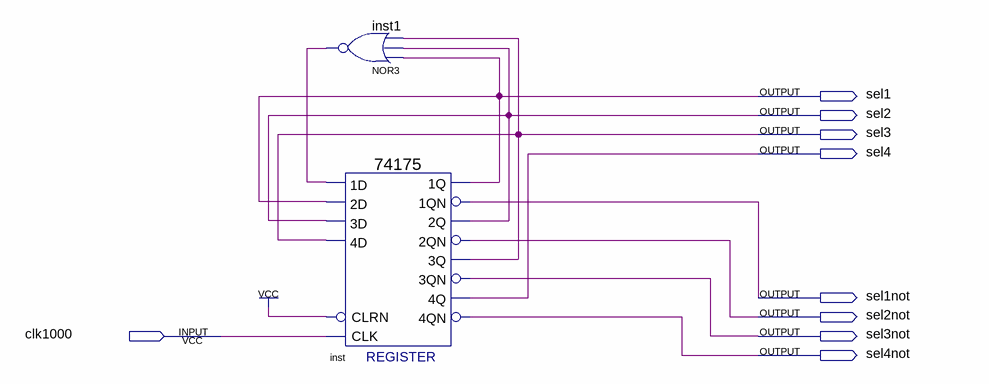
[diagram p0: schematic sheet]
// Quartus schematic dyn_gen.bdf as structural Verilog: 2 symbols, 9 pins
module dyn_gen (
  input  clk1000,
  output sel1,
  output sel2,
  output sel3,
  output sel4,
  output sel1not,
  output sel2not,
  output sel3not,
  output sel4not
);

  wire inst1_out;

  nor inst1 (inst1_out, sel1, sel2, sel3);
  \74175  inst (
    .CLRN(1'b1), .CLK(clk1000), .\3D (sel2), .\2D (sel1), .\1D (inst1_out), .\4D (sel3), .\1QN (sel1not),
    .\1Q (sel1), .\2QN (sel2not), .\3Q (sel3), .\2Q (sel2), .\4QN (sel4not), .\4Q (sel4), .\3QN (sel3not));
endmodule
